# EasyEDA schematic 1-Schematic_alan babu.json
TITLE: Smart meter; REV: 1.0; Date: 2025-07-29; Sheet: 1/1; Drawn By: sooryajohn111; Company: Soorya ka industry ??
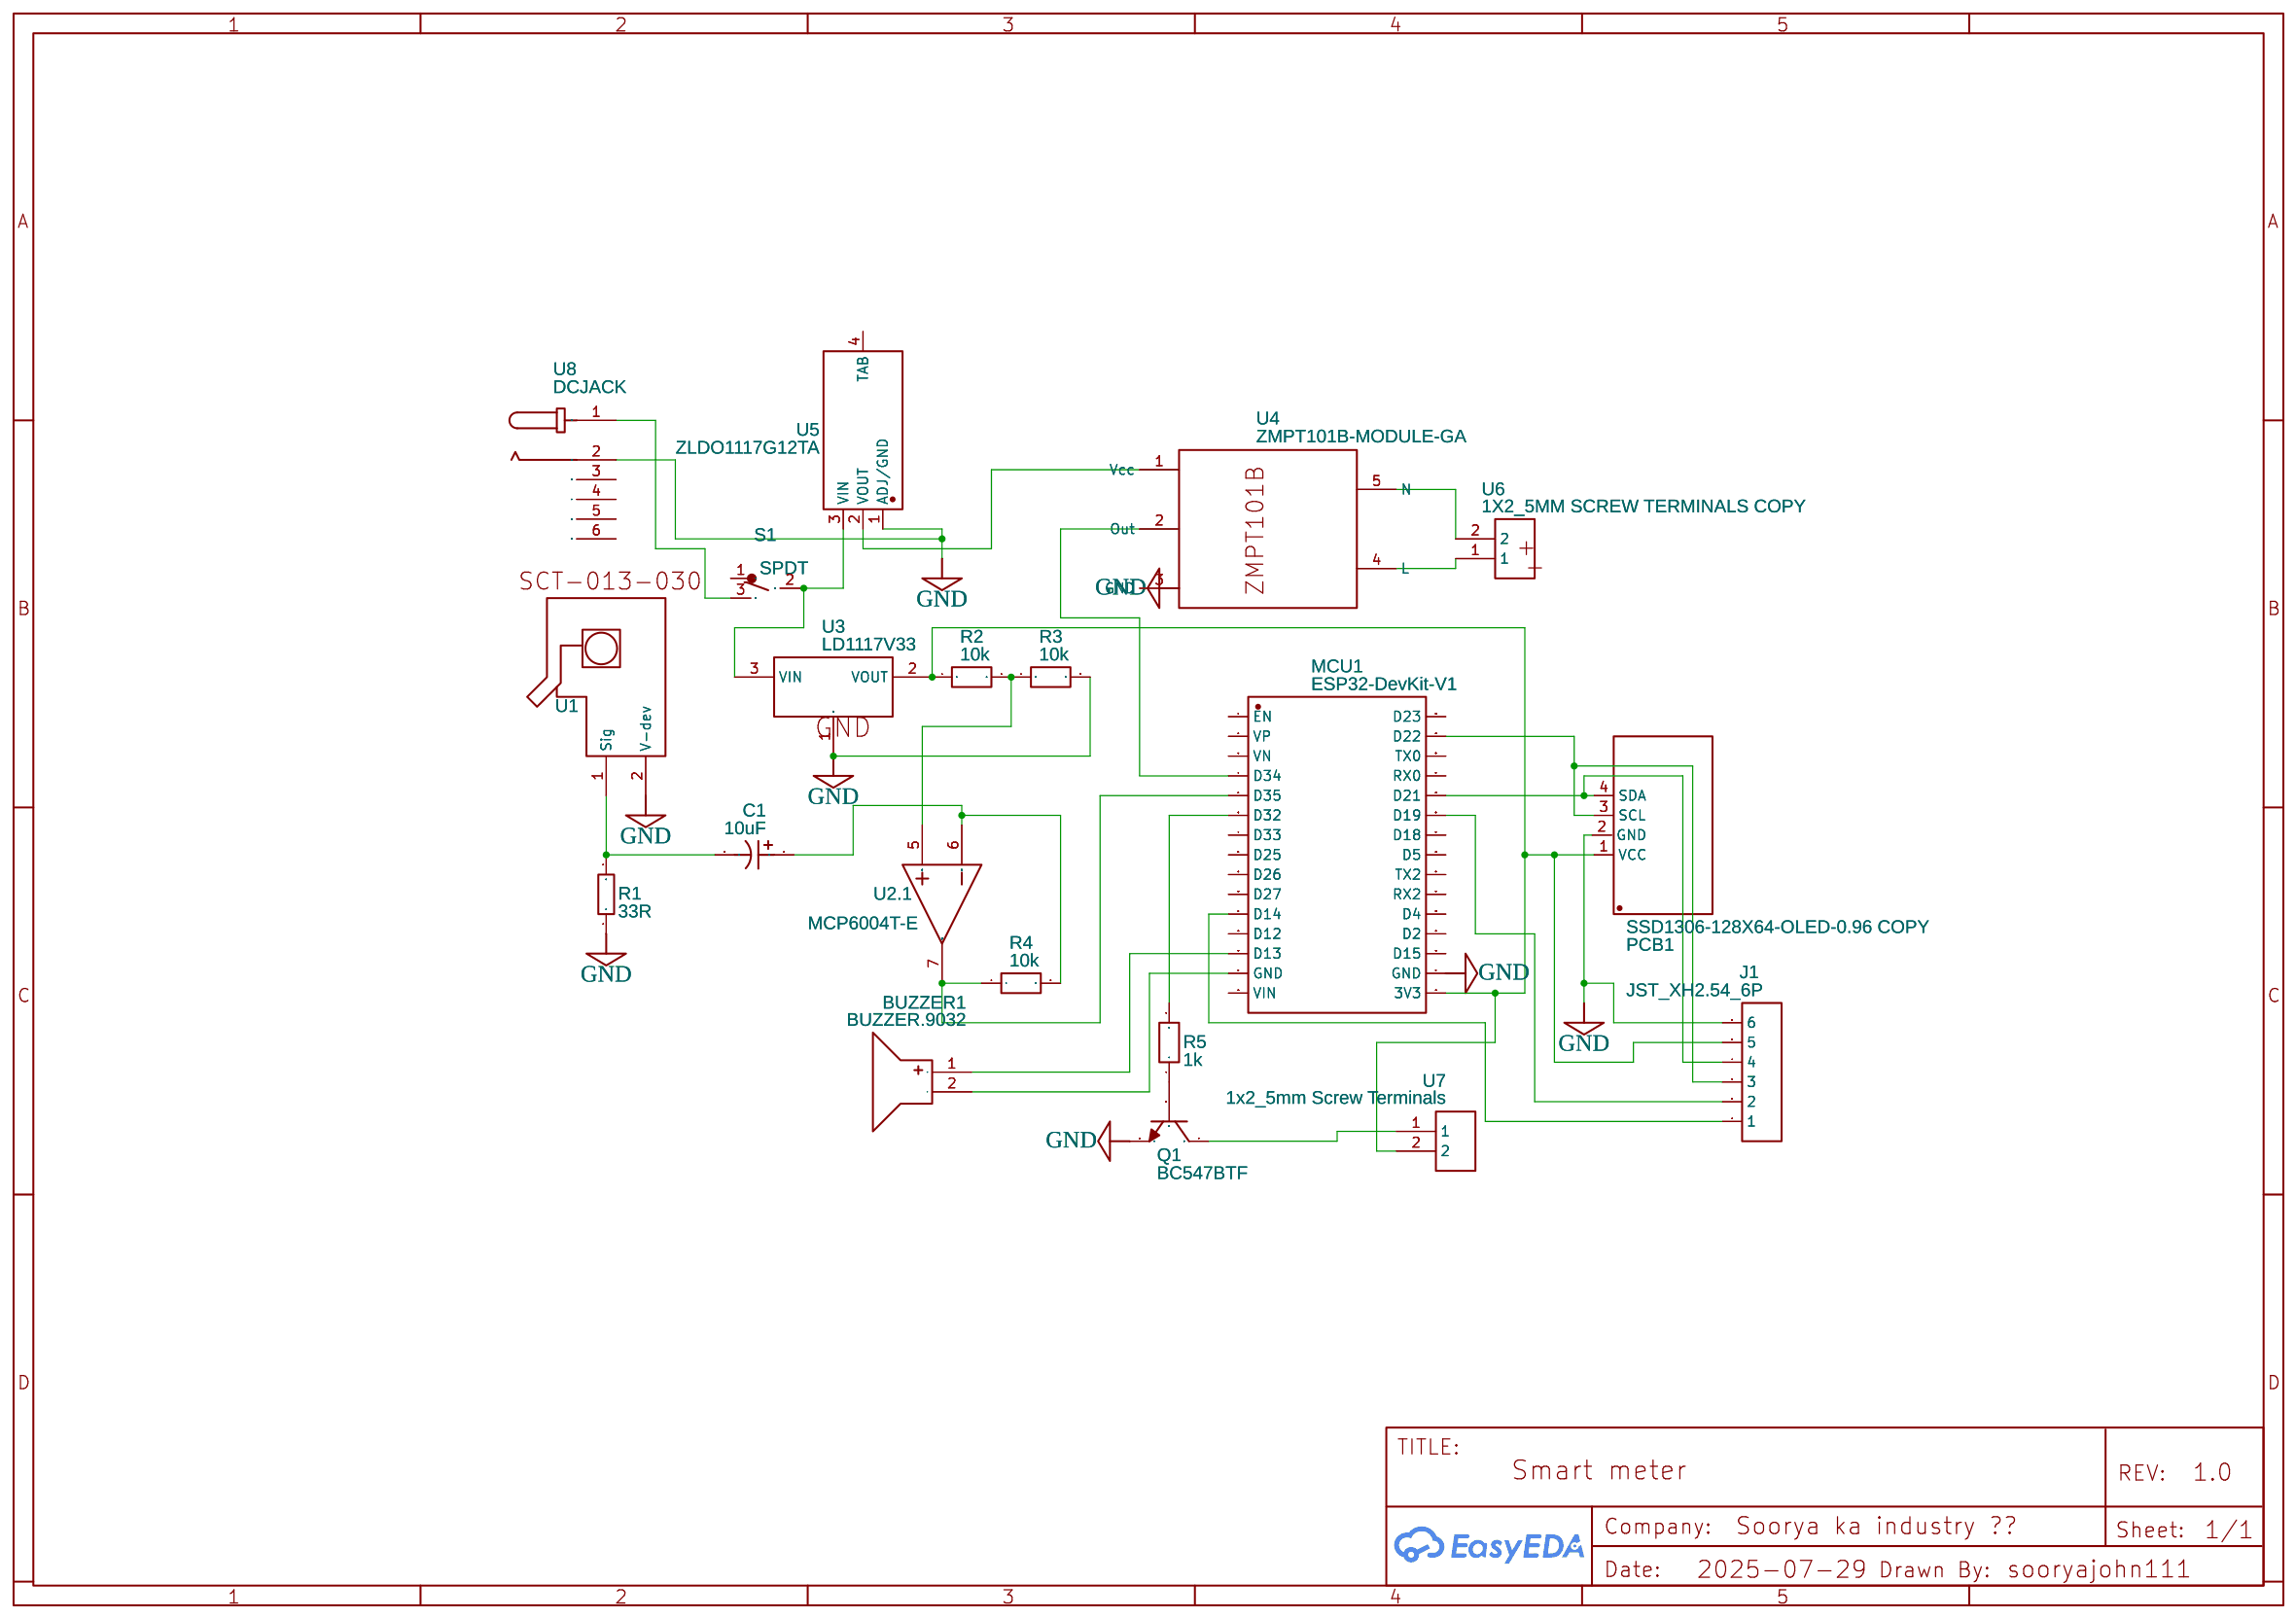
[diagram p0: schematic sheet]

## Parts
BUZZER1  BUZZER.9032  [BUZ-SMD_2P-L10.5-W9.0-P10.50-R]
C1  10uF  [CAP-SMD_BD4.0-L4.3-W4.3-LS5.1-FD]
J1  JST_XH2.54_6P  [6PIN_2.54_MM_JST_XHP_JST_CONNECTOR_FOR_DC_SOCKET]
MCU1  ESP32-DevKit-V1  [ESP32-DEVKIT-V1-FOOTPRINT]
PCB1  SSD1306-128X64-OLED-0.96 COPY  [SSD1306]
Q1  BC547BTF  [TO-92-3_L4.9-W3.7-P2.54-L]
R1  33R  [AXIAL-0.6]
R2  10k  [R_AXIAL-1.0]
R3  10k  [R_AXIAL-1.0]
R4  10k  [R_AXIAL-1.0]
R5  1k  [R_AXIAL-1.0]
S1  SPDT  [SWITCH-ESWITCH-SLIDE-TH-EG1218]
U1  SCT-013-XXX  [SCT-013-030]
U2  MCP6004T-E  [SOIC-14_L8.7-W3.9-P1.27-LS6.0-BL]  (section 1)
U3  LD1117V33  [TO-220-3_L10.0-W4.5-P2.54-L]
U4  ZMPT101B-MODULE-GA  [ZMPT101B-MODULE]
U5  ZLDO1117G12TA  [SOT-223_L6.5-W3.5-P2.30-LS7.0-BR]
U6  1X2_5MM SCREW TERMINALS COPY  [1X2 5MM SCREW TERMINALS]
U7  1x2_5mm Screw Terminals  [1X2 5MM SCREW TERMINALS]
U8  DCJACK  [DC-IN-TH_DCJACK]

## Library data of the parts
BUZZER1 = BUZZER.9032: Contributor: LCSC; Supplier: LCSC; Supplier Part: C9900002564; Manufacturer: null; JLCPCB Part Class: Extended Part
C1 = FZ10UF25V90RV0144: Supplier: LCSC; Supplier Part: C5155338; Manufacturer: KNSCHA(科尼盛); JLCPCB Part Class: Extended Part; Contributor: lcsc
J1 = JST_XH2.54_6P: Contributor: Андрей Скиффи
MCU1 = ESP32-DevKit-V1: Manufacturer: Espressif; Supplier: Aliexpress; Contributor: yared.getachew.tessema
PCB1 = SSD1306-128X64-OLED-0.96 COPY: sourceId: wICUcuL3l
Q1 = BC547BTF: Contributor: LCSC; Supplier: LCSC; Supplier Part: C900798; Manufacturer: onsemi(安森美); JLCPCB Part Class: Extended Part
R1 = axial resistor 0.5: Supplier: LCSC; Supplier Part: C348838; Manufacturer: ResistorToday; Manufacturer Part: EWWR0001J20R0T9; Contributor: LCSC
R2-R5 = R_AXIAL-1.0_EU: Contributor: LCEDA_Lib
S1 = SWITCH-SLIDE-SPDT-200MA-30V: Contributor: gokmenim
U1 = SCT-013-XXX: Manufacturer Part: New SchematicLib; Contributor: titedon
U2 = MCP6004T-E/SLVAO: subpart_no: 1; Supplier: LCSC; Supplier Part: C1347151; Manufacturer: MICROCHIP(美国微芯); JLCPCB Part Class: Extended Part; Contributor: viktor2506s
U3 = LD1117V33: Contributor: LCSC; Supplier: LCSC; Supplier Part: C283467; Manufacturer: ST(意法半导体); JLCPCB Part Class: Extended Part
U4 = ZMPT101B-MODULE-GA: Supplier: Boudbrousse; Contributor: boudbrousse
U5 = ZLDO1117G12TA: Contributor: LCSC; Supplier: LCSC; Supplier Part: C156270; Manufacturer: DIODES(美台)
U6 = 1X2_5MM SCREW TERMINALS COPY: Manufacturer Part: 1x2 5mm Screw Terminals; Contributor: kuhel; Supplier: LCSC
U7 = 1x2_5mm Screw Terminals: Manufacturer Part: 1x2 5mm Screw Terminals; Contributor: panagiotis96
U8 = DCJACK: Contributor: LCSC; Supplier: LCSC; Supplier Part: C9900000996; Manufacturer: null; JLCPCB Part Class: Extended Part

## Nets
GND: J1.6 MCU1.17(GND) PCB1.2(GND) Q1.3(E) R1.1 R3.2 U1.2(V-dev) U3.1(GND) U4.3(GND) U5.1(ADJ/GND) U8.2
Net-(BUZZER1-1): BUZZER1.1(+) MCU1.13(D13)
Net-(BUZZER1-2): BUZZER1.2(-) MCU1.14(GND)
Net-(C1-1): C1.1 R4.2 U2.6(IN B-)
Net-(C1-2): C1.2 R1.2 U1.1(Sig)
Net-(J1-1): J1.1 MCU1.11(D14)
Net-(J1-2): J1.2 MCU1.25(D19)
Net-(J1-3): J1.3 MCU1.29(D22) PCB1.3(SCL)
Net-(J1-4): J1.4 MCU1.26(D21) PCB1.4(SDA)
Net-(J1-5): J1.5 MCU1.16(3V3) PCB1.1(VCC) R2.1 U3.2(VOUT) U7.2
Net-(MCU1-4): MCU1.4(D34) U4.2(Out)
Net-(MCU1-5): MCU1.5(D35) R4.1 U2.7(OUT B)
Net-(MCU1-6): MCU1.6(D32) R5.2
Net-(Q1-1): Q1.1(C) U7.1
Net-(Q1-2): Q1.2(B) R5.1
Net-(R2-2): R2.2 R3.1 U2.5(IN B+)
Net-(S1-2): S1.2 U3.3(VIN) U5.3(VIN)
Net-(S1-3): S1.3 U8.1
Net-(U4-1): U4.1(Vcc) U5.2(VOUT)
Net-(U4-4): U4.4(L) U6.1
Net-(U4-5): U4.5(N) U6.2

Not connected (* = marked no-connect by the designer): MCU1 1(EN) 2(VP) 3(VN) 7(D33) 8(D25) 9(D26) 10(D27) 12(D12) 15(VIN) 18(D15) 19(D2) 20(D4) 21(RX2) 22(TX2) 23(D5) 24(D18) 27(RX0) 28(TX0) 30(D23); S1 1; U5 4(TAB); U8 3 4 5 6
